# Altium schematic sheet Client_sheet1.SchDoc: Project Vega - Client Node
size A4; DrawnBy: Jithendra H S; Revision: 1; SheetNumber: 5; SheetTotal: 8
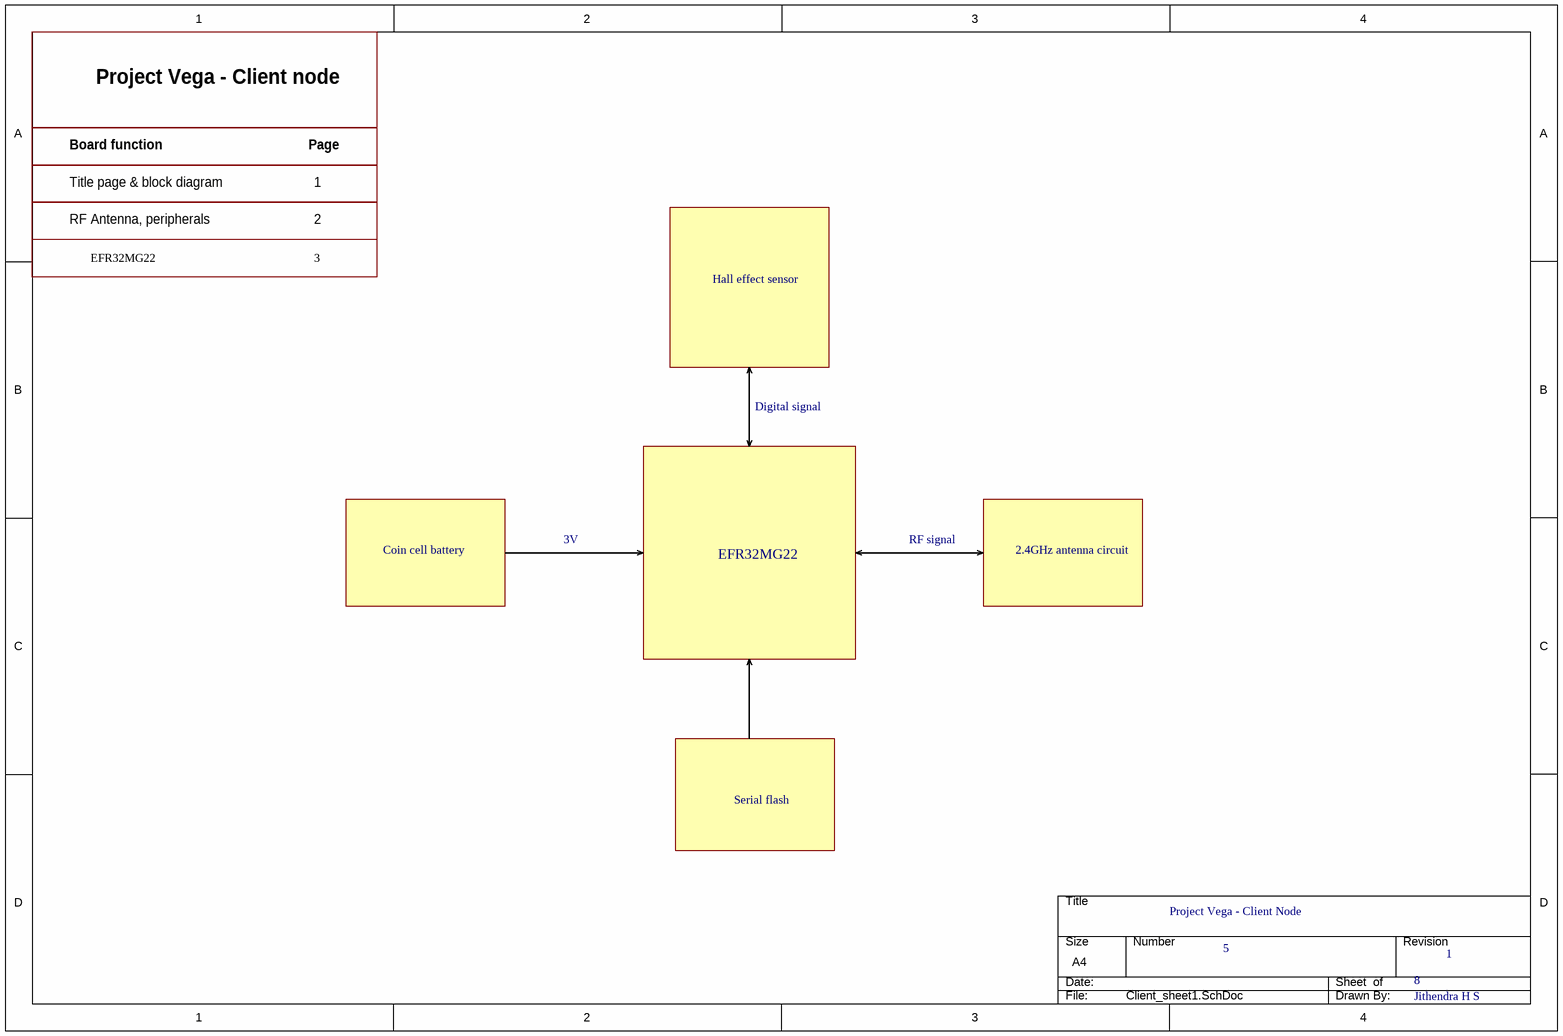
[diagram p0: Client_sheet1.SchDoc]

## Notes on the sheet
- Project Vega - Client node
- Board function
- Page
- Title page & block diagram
- RF Antenna, peripherals
- 1
- 2
- EFR32MG22
- 3
- Hall effect sensor
- Digital signal
- Coin cell battery
- 3V
- RF signal
- 2.4GHz antenna circuit
- Serial flash